# Altium schematic sheet Heater.SchDoc: 回流焊加热台
size A3; Author: 单推憨色_卷心菜拾秋Official; DrawnBy: 单推憨色_卷心菜拾秋Official; SheetNumber: 1; SheetTotal: 1
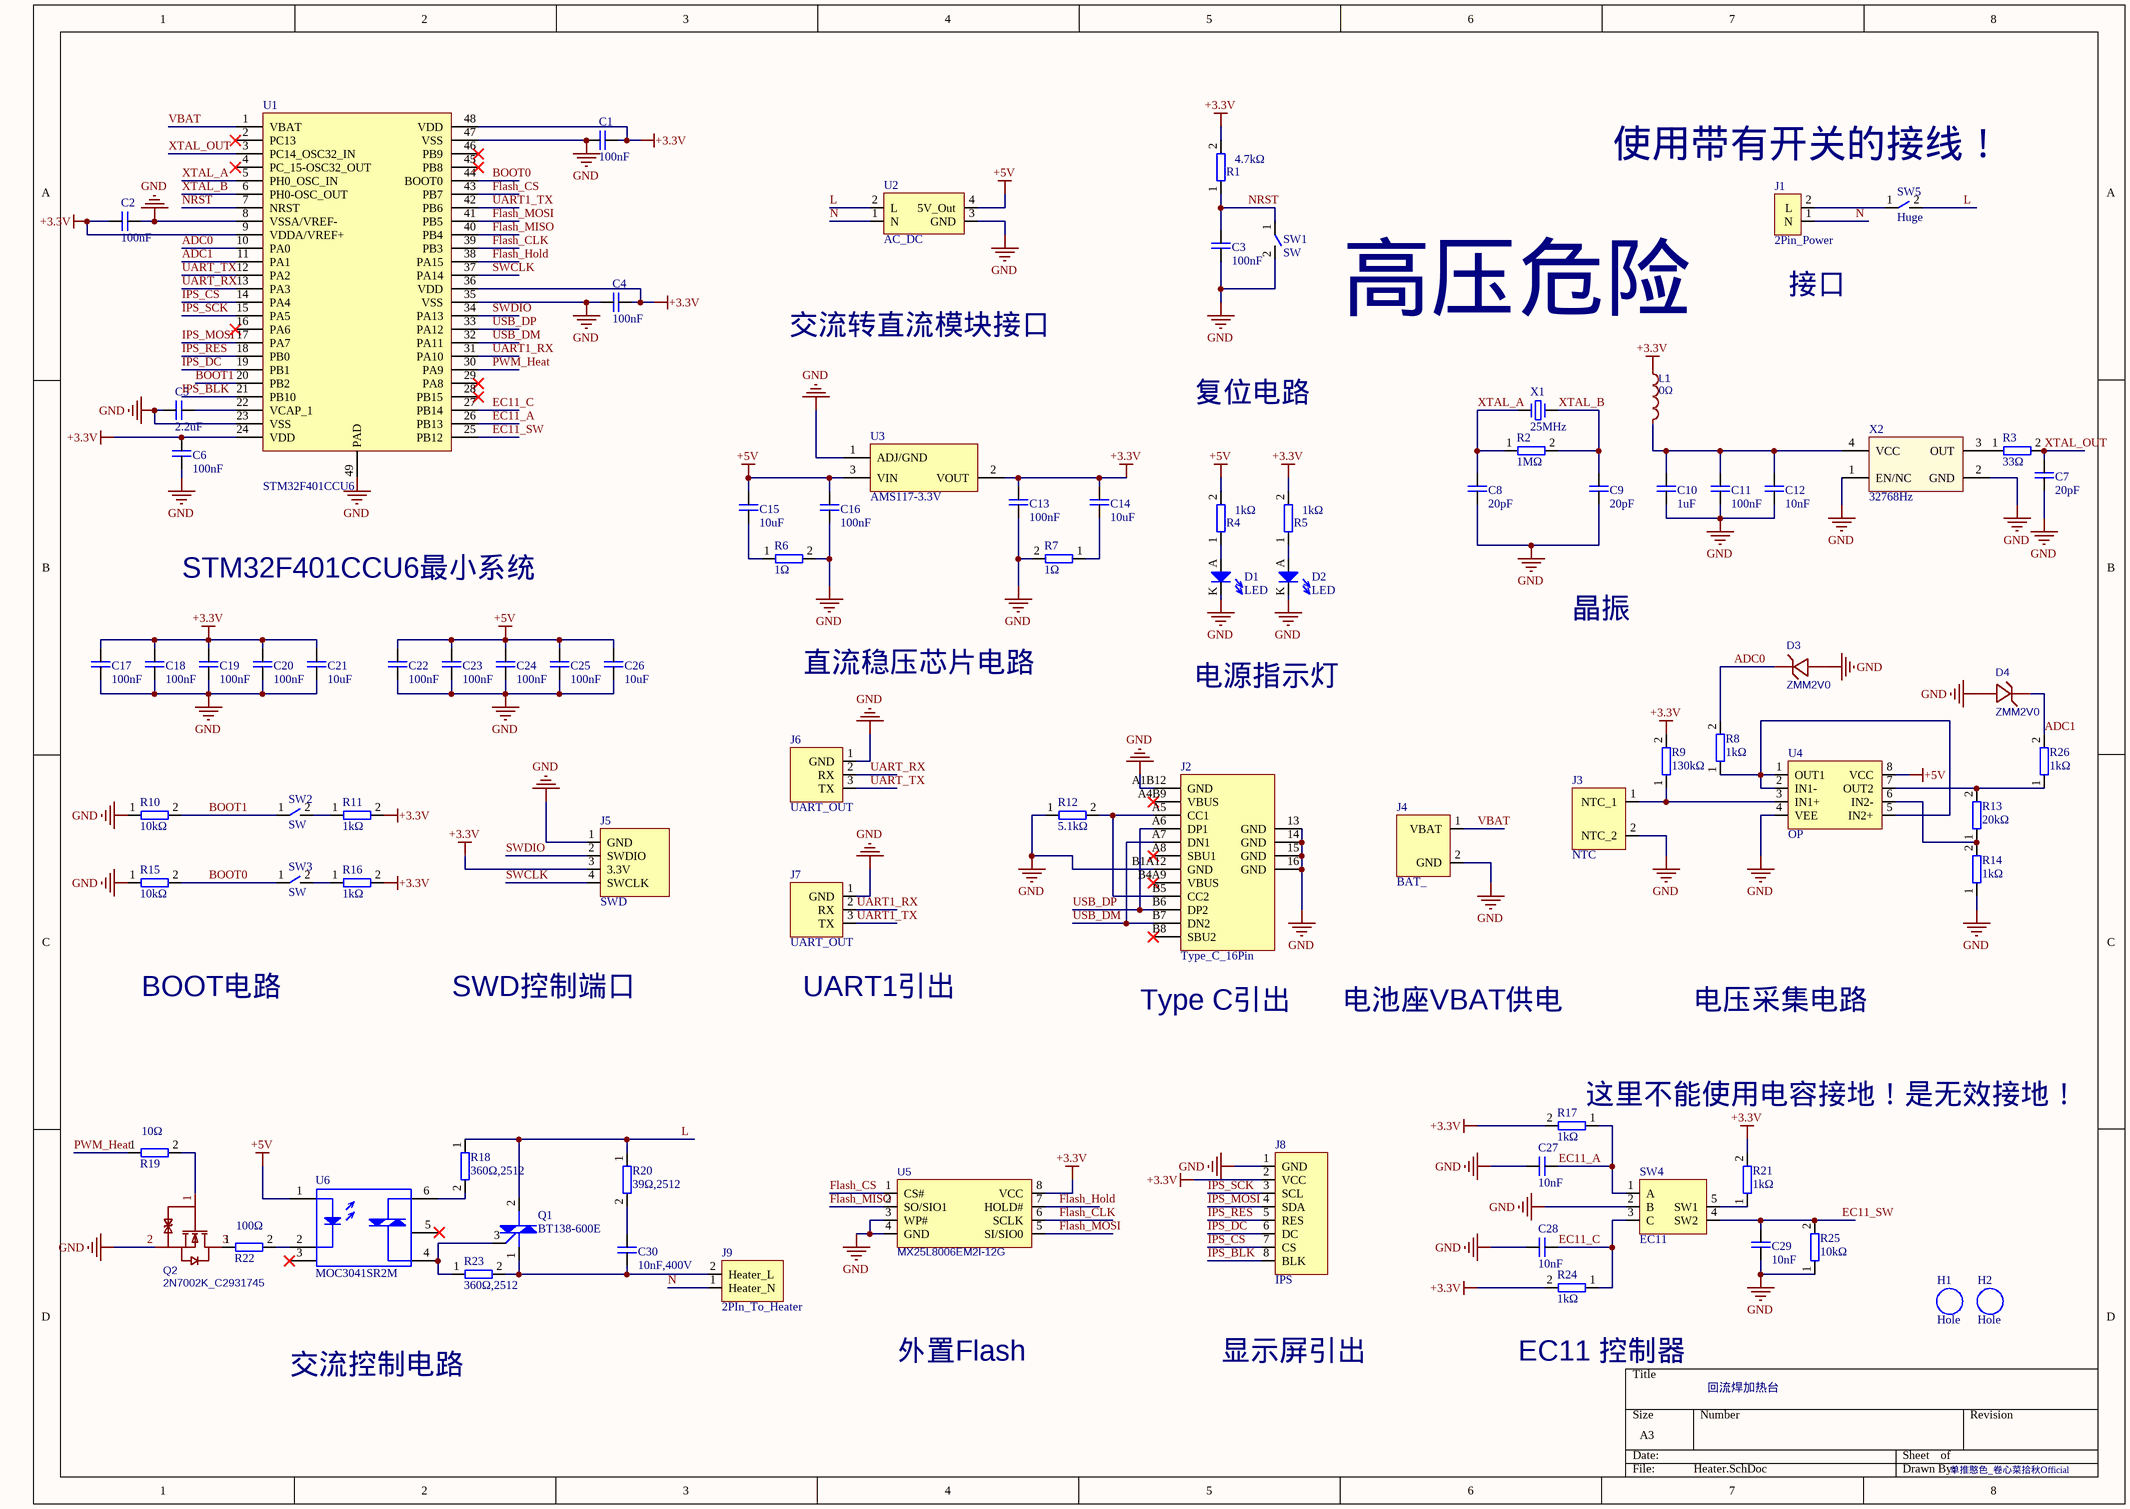
[diagram p0: Heater.SchDoc]

## Parts
C1  100nF  [0603_C]
C2  100nF  [0603_C]
C3  100nF  [0603_C]
C4  100nF  [0603_C]
C5  2.2uF  [0603_C]
C6  100nF  [0603_C]
C7  20pF  [0603_C]
C8  20pF  [0603_C]
C9  20pF  [0603_C]
C10  1uF  [0603_C]
C11  100nF  [0603_C]
C12  10nF  [0603_C]
C13  100nF  [0603_C]
C14  10uF  [0603_C]
C15  10uF  [0603_C]
C16  100nF  [0603_C]
C17  100nF  [0603_C]
C18  100nF  [0603_C]
C19  100nF  [0603_C]
C20  100nF  [0603_C]
C21  10uF  [0603_C]
C22  100nF  [0603_C]
C23  100nF  [0603_C]
C24  100nF  [0603_C]
C25  100nF  [0603_C]
C26  10uF  [0603_C]
C27  10nF  [0603_C]
C28  10nF  [0603_C]
C29  10nF  [0603_C]
C30  10nF,400V  [2PIN - BigCap]
D1  LED  [0603_LED]
D2  LED  [0603_LED]
D3  ZMM2V0  [LL-34_L3.5-W1.5-RD]
D4  ZMM2V0  [LL-34_L3.5-W1.5-RD]
H1  Hole  [Hole]
H2  Hole  [Hole]
J1  2Pin_Power  [Power-AC-2Pin]
J2  Type_C_16Pin  [USB-C-SMD_TYPEC-304-BCP16]
J3  NTC  [2PIN]
J4  BAT_  [VBAT]
J5  SWD  [4PIN]
J6  UART_OUT  [3Pin]
J7  UART_OUT  [3Pin]
J8  IPS  [IPS_8PIN - Simplified]
J9  2PIn_To_Heater  [CONN-TH_2.54-2P]
L1  0Ω  [L0603]
Q1  BT138-600E  [TO-220-3_L10.0-W4.5-P2.54-L]
Q2  2N7002K_C2931745  [SOT-23-3_NMOS]
R1  4.7kΩ  [0603 _R]
R2  1MΩ  [0603 _R]
R3  33Ω  [0603 _R]
R4  1kΩ  [0603 _R]
R5  1kΩ  [0603 _R]
R6  1Ω  [0603 _R]
R7  1Ω  [0603 _R]
R8  1kΩ  [0603 _R]
R9  130kΩ  [0603 _R]
R10  10kΩ  [0603 _R]
R11  1kΩ  [0603 _R]
R12  5.1kΩ  [0603 _R]
R13  20kΩ  [0603 _R]
R14  1kΩ  [0603 _R]
R15  10kΩ  [0603 _R]
R16  1kΩ  [0603 _R]
R17  1kΩ  [0603 _R]
R18  360Ω,2512  [2512_R]
R19  10Ω  [0603 _R]
R20  39Ω,2512  [2512_R]
R21  1kΩ  [0603 _R]
R22  100Ω  [0603 _R]
R23  360Ω,2512  [2512_R]
R24  1kΩ  [0603 _R]
R25  10kΩ  [0603 _R]
R26  1kΩ  [0603 _R]
SW1  SW  [SW-SMD_5P-L6.4-W6.2-P4.50-LS8.2-TL]
SW2  SW  [SW-SMD_5P-L6.4-W6.2-P4.50-LS8.2-TL]
SW3  SW  [SW-SMD_5P-L6.4-W6.2-P4.50-LS8.2-TL]
SW4  EC11  [EC11]
SW5  Huge  [SW]
U1  STM32F401CCU6  [UFQFPN-48_L7.0-W7.0-P0.50-BL-EP]
U2  AC_DC  [AC_TO_DC]
U3  AMS117-3.3V  [SOT-223-3_L6.5-W3.4-P2.30-LS7.0-BR]
U4  OP  [SOP-8_OP]
U5  MX25L8006EM2I-12G  [SOP-8_L5.3-W5.3-P1.27-LS8.0-BL]
U6  MOC3041SR2M  [DIP-6_MO]
X1  25MHz  [HC-49US_L11.0-W4.6-P4.88 - duplicate]
X2  32768Hz  [OSC 3225]

## Nets
+3.3V: C1.1 C2.1 C4.1 C6.2 C13.1 C14.1 C17.1 C18.1 C19.1 C20.1 C21.1 J5.3(3.3V) J8.2(VCC) L1.1 R1.2 R5.2 R9.2 R11.2 R16.2 R17.2 R21.2 R24.2 U1.9(VDDA/VREF+) U1.24(VDD) U1.36(VDD) U1.48(VDD) U3.2(VOUT) U5.8(VCC)
+5V: C15.2 C16.2 C22.1 C23.1 C24.1 C25.1 C26.1 R4.2 U2.4(5V_Out) U3.3(VIN) U4.8(VCC) U6.1(Anode)
GND: C1.2 C2.2 C3.2 C4.2 C5.1 C6.1 C7.2 C8.2 C9.2 C10.2 C11.2 C12.2 C13.2 C16.1 C17.2 C18.2 C19.2 C20.2 C21.2 C22.2 C23.2 C24.2 C25.2 C26.2 C27.1 C28.1 C29.2 D1.K D2.K D3.2(A) D4.2(A) J2.13(GND) J2.14(GND) J2.15(GND) J2.16(GND) J2.A1B12(GND) J2.B1A12(GND) J3.2(NTC_2) J4.2(GND) J5.1(GND) J6.1(GND) J7.1(GND) J8.1(GND) Q2.2(S) R6.2 R7.2 R10.1 R12.1 R14.1 R15.1 R25.1 SW1.2 SW4.2(B) U1.8(VSSA/VREF-) U1.23(VSS) U1.35(VSS) U1.47(VSS) U1.49(PAD) U2.3(GND) U3.1(ADJ/GND) U4.4(VEE) U5.3(WP#) U5.4(GND) X2.1(EN/NC) X2.2(GND)
ADC0: D3.1(C) R8.2 U1.10(PA0)
ADC1: D4.1(C) R26.2 U1.11(PA1)
BOOT0: R15.2 SW3.1 U1.44(BOOT0)
BOOT1: R10.2 SW2.1 U1.20(PB2)
EC11_A: C27.2 R17.1 SW4.1(A) U1.26(PB13)
EC11_C: C28.2 R24.1 SW4.3(C) U1.27(PB14)
EC11_SW: C29.1 R25.2 SW4.4(SW2) U1.25(PB12)
Flash_CLK: U1.39(PB3) U5.6(SCLK)
Flash_CS: U1.43(PB7) U5.1(CS#)
Flash_Hold: U1.38(PA15) U5.7(HOLD#)
Flash_MISO: U1.40(PB4) U5.2(SO/SIO1)
Flash_MOSI: U1.41(PB5) U5.5(SI/SIO0)
IPS_BLK: J8.8(BLK) U1.21(PB10)
IPS_CS: J8.7(CS) U1.14(PA4)
IPS_DC: J8.6(DC) U1.19(PB1)
IPS_MOSI: J8.4(SDA) U1.17(PA7)
IPS_RES: J8.5(RES) U1.18(PB0)
IPS_SCK: J8.3(SCL) U1.15(PA5)
L: Q1.2 R18.1 R20.1 SW5.2 U2.2(L)
N: J1.1(N) J9.1(Heater_N) U2.1(N)
NRST: C3.1 R1.1 SW1.1 U1.7(NRST)
PWM_Heat: R19.1 U1.30(PA9)
SWCLK: J5.4(SWCLK) U1.37(PA14)
SWDIO: J5.2(SWDIO) U1.34(PA13)
UART1_RX: J7.2(RX) U1.31(PA10)
UART1_TX: J7.3(TX) U1.42(PB6)
UART_RX: J6.2(RX) U1.13(PA3)
UART_TX: J6.3(TX) U1.12(PA2)
USB_DM: J2.A7(DN1) J2.B7(DN2) U1.32(PA11)
USB_DP: J2.A6(DP1) J2.B6(DP2) U1.33(PA12)
VBAT: J4.1(VBAT) U1.1(VBAT)
XTAL_A: C8.1 R2.1 U1.5(PH0_OSC_IN) X1.1
XTAL_B: C9.1 R2.2 U1.6(PH0-OSC_OUT) X1.2
XTAL_OUT: C7.1 R3.2 U1.3(PC14_OSC32_IN)
NetC5_2: C5.2 U1.22(VCAP_1)
NetC10_1: C10.1 C11.1 C12.1 L1.2 X2.4(VCC)
NetC14_2: C14.2 R7.1
NetC15_1: C15.1 R6.1
NetC30_1: C30.1 J9.2(Heater_L) Q1.1 R23.2
NetC30_2: C30.2 R20.2
NetD1_A: D1.A R4.1
NetD2_A: D2.A R5.1
NetJ1_2: J1.2(L) SW5.1
NetJ2_A5: J2.A5(CC1) J2.B5(CC2) R12.2
NetJ3_1: J3.1(NTC_1) R9.1 U4.3(IN1+)
NetQ1_3: Q1.3 R23.1 U6.4(Main_Term)
NetQ2_1: Q2.1(G) R19.2
NetQ2_3: Q2.3(D) R22.1
NetR3_1: R3.1 X2.3(OUT)
NetR8_1: R8.1 U4.1(OUT1) U4.2(IN1-) U4.5(IN2+)
NetR11_1: R11.1 SW2.2
NetR13_1: R13.1 R14.2 U4.6(IN2-)
NetR13_2: R13.2 R26.1 U4.7(OUT2)
NetR16_1: R16.1 SW3.2
NetR18_2: R18.2 U6.6(Main_Term)
NetR21_1: R21.1 SW4.5(SW1)
NetR22_2: R22.2 U6.2(Cathode)

Not connected (* = marked no-connect by the designer): J2 A4B9(VBUS)* A8(SBU1)* B4A9(VBUS)* B8(SBU2)*; U1 2(PC13)* 4(PC_15-OSC32_OUT)* 16(PA6)* 28(PB15)* 29(PA8)* 45(PB8)* 46(PB9)*; U6 3(NC)* 5(NC)*

## Notes on the sheet
- (near J1) 使用带有开关的接线！
- (near J1) 接口
- 交流转直流模块接口
- 高压危险
- 复位电路
- STM32F401CCU6最小系统
- 晶振
- 直流稳压芯片电路
- 电源指示灯
- BOOT电路
- SWD控制端口
- (near J7) UART1引出
- (near J2) Type C引出
- 电池座VBAT供电
- 电压采集电路
- (near R17) 这里不能使用电容接地！是无效接地！
- 交流控制电路
- 外置Flash
- 显示屏引出
- (near R24) EC11 控制器

## Library data of the parts
C1-C30 = Capacitor
D3 D4 = ZMM2V0: BOM_Manufacturer: SEMTECH; BOM_Supplier: LCSC; BOM_Manufacturer Part: ZMM2V0; BOM_Supplier Part: C8079; BOM_JLCPCB Part Class: Extended Part; spicePre: D; spiceSymbolName: ZMM2V0
L1 = 0Ω: BOM_Manufacturer: FH; BOM_Manufacturer Part: CBW160808U000T; nameAlias: Value; BOM_Supplier: LCSC; BOM_Supplier Part: C139173; BOM_JLCPCB Part Class: Extended Part; spicePre: L; spiceSymbolName: CBW160808U000T
Q2 = 2N7002K_C2931745: BOM_Manufacturer: Doeshare（德芯); Contributor: LCSC; BOM_Supplier: LCSC; BOM_Supplier Part: C2931745; BOM_Manufacturer Part: 2N7002K; spicePre: Q; spiceSymbolName: 2N7002K_C2931745
R1-R26 = Resistor
SW5 = SW_DA
U3 = ASM1117-3.3V
U5 = MX25L8006EM2I-12G: BOM_Manufacturer: Micronix; BOM_Supplier: LCSC; BOM_Manufacturer Part: MX25L8006EM2I-12G; BOM_Supplier Part: C71947; BOM_JLCPCB Part Class: Extended Part; spicePre: U; spiceSymbolName: MX25L8006EM2I-12G
X1 = XTAL-2P: 2脚无源脚晶振; 版权归属: 源创客; BOM名称: 2脚无源脚晶振; 学习资源: www.ooocke.com
X2 = XTAL-ACT-4P: 4脚有源晶振; 版权归属: 源创客; BOM名称: 4脚有源晶振; 学习资源: www.ooocke.com